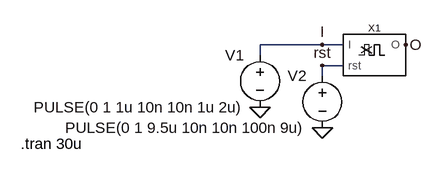
[diagram p0: schematic test-ignore_first_pulse.asc]
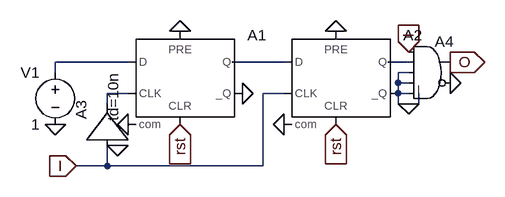
[diagram p1: sub-circuit ignore_first_pulse.asc]
test-ignore_first_pulse.asc, the LTspice schematic file:
Version 4
SHEET 1 880 680
WIRE 96 160 0 160
WIRE 128 160 96 160
WIRE 0 176 0 160
WIRE 128 192 96 192
WIRE 96 208 96 192
FLAG 96 288 0
FLAG 0 256 0
FLAG 96 160 I
FLAG 224 160 O
FLAG 96 192 rst
SYMBOL ignore_first_pulse 176 176 R0
SYMATTR InstName X1
SYMBOL voltage 0 160 M0
WINDOW 123 0 0 Left 0
WINDOW 39 0 0 Left 0
SYMATTR InstName V1
SYMATTR Value PULSE(0 1 1u 10n 10n 1u 2u)
SYMBOL voltage 96 192 M0
WINDOW 123 0 0 Left 0
WINDOW 39 0 0 Left 0
SYMATTR InstName V2
SYMATTR Value PULSE(0 1 9.5u 10n 10n 100n 9u)
TEXT -368 312 Left 2 !.tran 30u

ignore_first_pulse.asc, the sub-circuit schematic file:
Version 4
SHEET 1 880 680
WIRE 32 192 -80 192
WIRE 272 192 192 192
WIRE 464 192 432 192
WIRE -80 208 -80 192
WIRE 464 208 448 208
WIRE 448 224 448 208
WIRE 464 224 448 224
WIRE 32 240 0 240
WIRE 272 240 240 240
WIRE 448 240 448 224
WIRE 464 240 448 240
WIRE 0 256 0 240
WIRE 448 256 448 240
WIRE 464 256 448 256
WIRE 480 256 480 240
WIRE 480 256 464 256
WIRE 0 352 0 320
WIRE 0 352 -48 352
WIRE 240 352 240 240
WIRE 240 352 0 352
FLAG 112 144 0
FLAG 32 288 0
FLAG -48 352 I
IOPIN -48 352 In
FLAG -80 288 0
FLAG 112 288 rst
IOPIN 112 288 In
FLAG 352 144 0
FLAG 272 288 0
FLAG 352 288 rst
IOPIN 352 288 In
FLAG 16 320 0
FLAG 208 240 0
FLAG 464 256 0
FLAG 528 224 0
FLAG 464 176 I
IOPIN 464 176 In
FLAG 528 192 O
IOPIN 528 192 Out
SYMBOL Digital\\dflop 112 144 R0
SYMATTR InstName A1
SYMBOL voltage -80 192 M0
SYMATTR InstName V1
SYMATTR Value 1
SYMBOL Digital\\dflop 352 144 R0
SYMATTR InstName A2
SYMBOL Digital\\buf1 -64 320 R270
WINDOW 3 37 73 Left 0
SYMATTR InstName A3
SYMATTR Value td=10n
SYMBOL Digital\\and 496 144 R0
SYMATTR InstName A4

The netlist it stands for:
* test-ignore_first_pulse.asc
XX1 I rst O ignore_first_pulse
V1 I 0 PULSE(0 1 1u 10n 10n 1u 2u)
V2 rst 0 PULSE(0 1 9.5u 10n 10n 100n 9u)

* block symbol definitions
.subckt ignore_first_pulse I rst O
A1 N001 0 N004 0 rst 0 N002 0 DFLOP
V1 N001 0 1
A2 N002 0 I 0 rst 0 N003 0 DFLOP
A3 I 0 0 0 0 0 N004 0 BUF td=10n
A4 I N003 0 0 0 0 O 0 AND
.ends ignore_first_pulse

.tran 30u
.backanno
.end